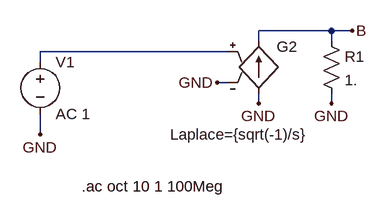
[diagram p0: schematic cplx1.asc]
cplx1.asc, the LTspice schematic file:
Version 4
SHEET 1 1540 912
WIRE 896 592 1184 592
WIRE 896 608 896 592
WIRE 896 688 896 720
WIRE 1232 672 1232 656
WIRE 1344 672 1344 656
WIRE 1232 576 1232 560
WIRE 1232 560 1344 560
WIRE 1344 560 1344 576
WIRE 1184 640 1168 640
WIRE 1344 560 1376 560
FLAG 896 720 GND
FLAG 1344 672 GND
FLAG 1232 672 GND
FLAG 1168 640 GND
FLAG 1376 560 B
SYMBOL voltage 896 592 R0
SYMATTR InstName V1
SYMATTR Value AC 1
SYMBOL g 1232 560 R0
WINDOW 0 28 24 Left 0
WINDOW 3 -136 160 Left 0
SYMATTR InstName G2
SYMATTR Value Laplace={sqrt(-1)/s}
SYMBOL res 1328 560 R0
SYMATTR InstName R1
SYMATTR Value 1.
TEXT 960 800 Left 0 !.ac oct 10 1 100Meg

The netlist it stands for:
* cplx1.asc
V1 N001 GND AC 1
G2 GND B N001 GND Laplace={sqrt(-1)/s}
R1 B GND 1.
.ac oct 10 1 100Meg
.backanno
.end